# Altium schematic sheet RS232.SchDoc
size A4
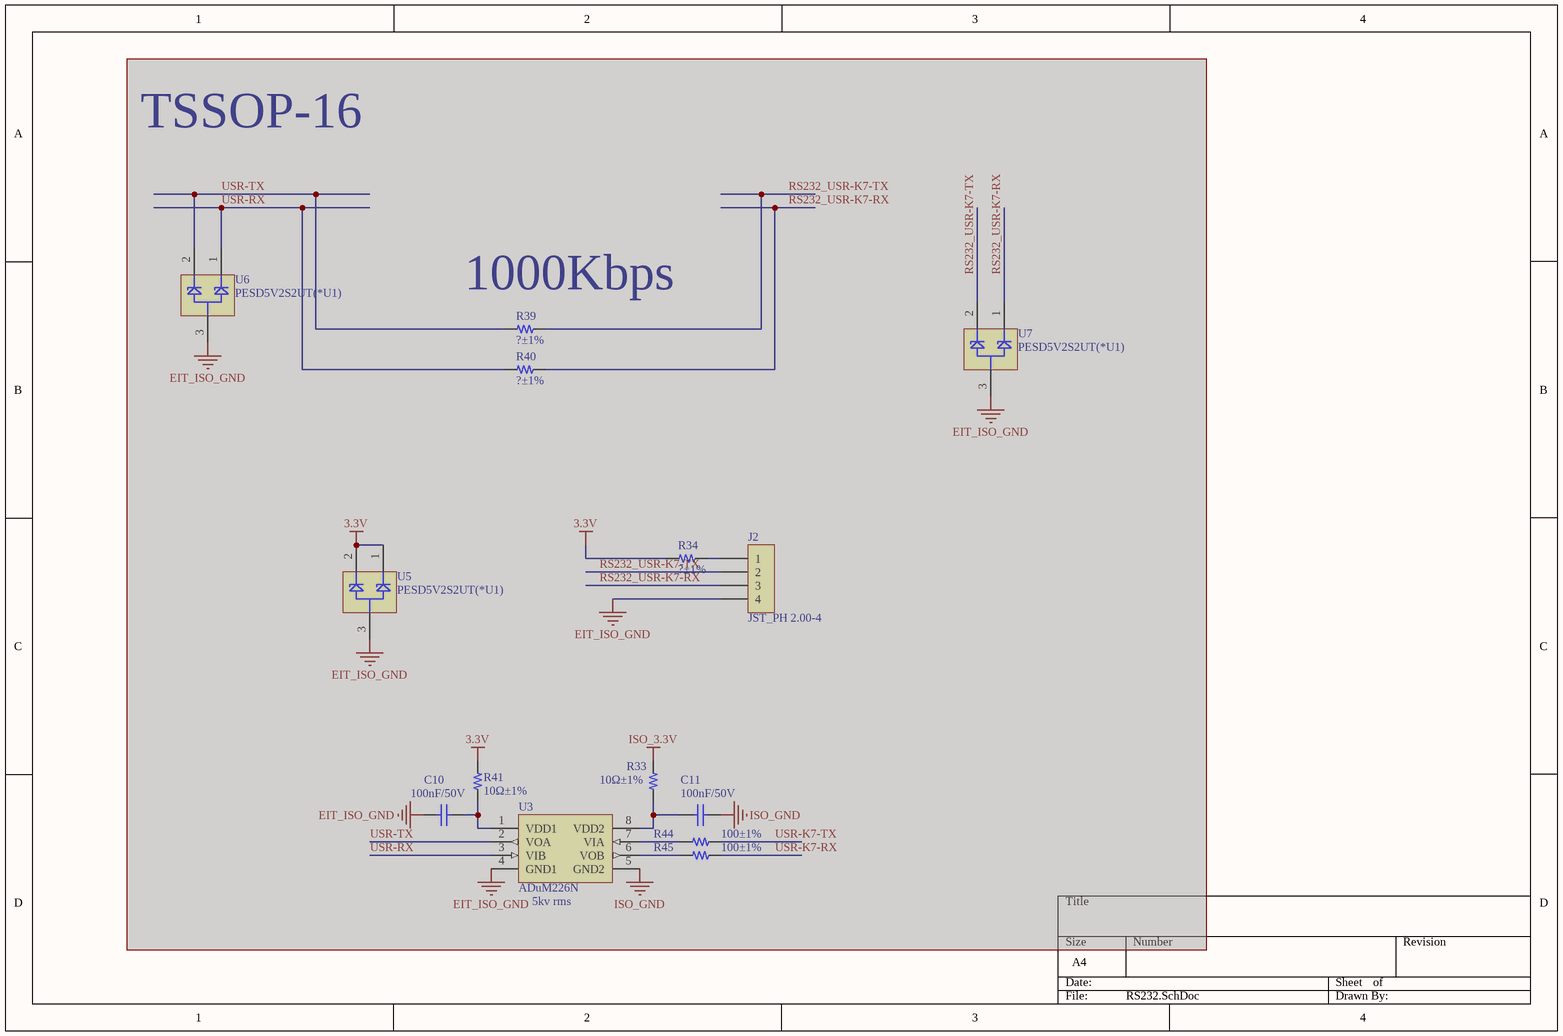
[diagram p0: RS232.SchDoc]

## Parts
C10  100nF/50V  [C-0603]  (masked out: inside a compile mask, not in the netlist)
C11  100nF/50V  [C-0603]  (masked out: inside a compile mask, not in the netlist)
J2  JST_PH 2.00-4  [JST_PH 2.00-4]  (masked out: inside a compile mask, not in the netlist)
R33  10Ω±1%  [R-0805]  (masked out: inside a compile mask, not in the netlist)
R34  ?±1%  [R-0805]  (masked out: inside a compile mask, not in the netlist)
R39  ?±1%  [R-0603]  (masked out: inside a compile mask, not in the netlist)
R40  ?±1%  [R-0603]  (masked out: inside a compile mask, not in the netlist)
R41  10Ω±1%  [R-0805]  (masked out: inside a compile mask, not in the netlist)
R44  100±1%  [R-0603]  (masked out: inside a compile mask, not in the netlist)
R45  100±1%  [R-0603]  (masked out: inside a compile mask, not in the netlist)
U3  ADuM226N  [SOIC-8(Wide Body)]  (masked out: inside a compile mask, not in the netlist)
U5  PESD5V2S2UT(*U1)  [SOT23-3]  (masked out: inside a compile mask, not in the netlist)
U6  PESD5V2S2UT(*U1)  [SOT23-3]  (masked out: inside a compile mask, not in the netlist)
U7  PESD5V2S2UT(*U1)  [SOT23-3]  (masked out: inside a compile mask, not in the netlist)

## Notes on the sheet
- TSSOP-16
- (near R39) 1000Kbps
- (near U3) 5kv rms

## Library data of the parts
C10 C11 = C-0603: 物料编号: *; 物料名称: *; 厂家: *; 详细描述: *
J2 = JST_PH 2.00-4: 品牌：JST 型号：B4B-PH-K-S，直插，间距2.00，4pin; 名称: 插座2针，2.0间距; 制造商: JST
R33 R34 R41 = R-0805
R39 R40 R44 R45 = R-0603
U3 = ADuM226N: 品牌：ADI，型号：ADuM226N0BRIZ,SOIC-8,-40~+105°C,ROHS
U5-U7 = PESD5V2S2UT: 品牌：NXP，型号：PESD5V2S2UT，SOT23-3，ROHS; 制造商: Philips; 名称: ESD保护PESD5V2S2UT; 详细描述: Philips,PESD5V2S2UT,SOT23-3,